# EAGLE design ITG-3200-v11 (EAGLE 6.4)
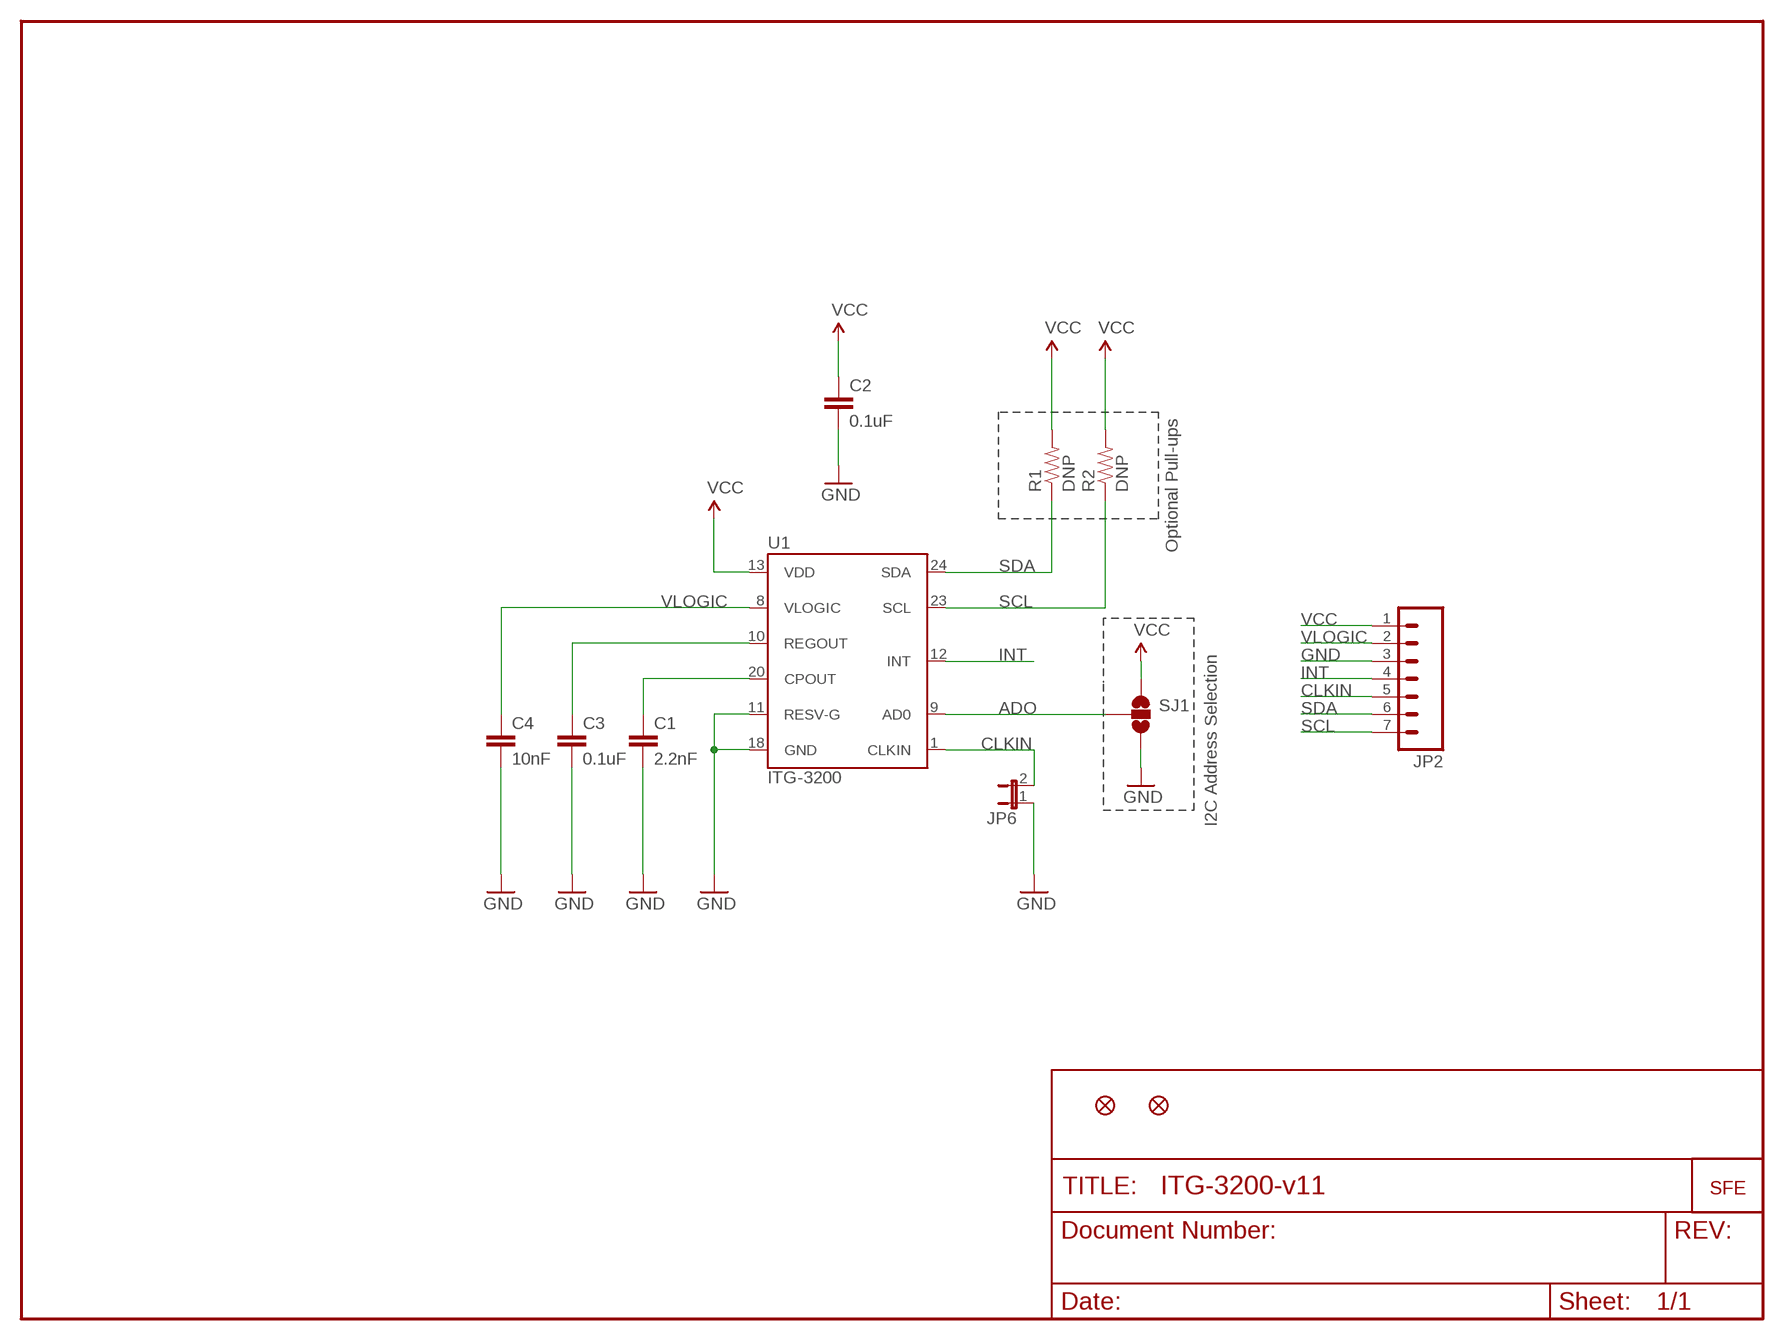
[diagram p0: schematic, sheet 1]

## Parts
C1  2.2nF  CAP0603-CAP  [0603-CAP]
C2  0.1uF  CAP0603-CAP  [0603-CAP]
C3  0.1uF  CAP0603-CAP  [0603-CAP]
C4  10nF  CAP0603-CAP  [0603-CAP]
JP1  LOGO-SFESK  [SFE-LOGO-FLAME]
JP2  M07  [1X07]
JP3  FIDUCIAL1X2  [FIDUCIAL-1X2]
JP4  FIDUCIAL1X2  [FIDUCIAL-1X2]
JP6  JUMPER-2SMD-NO  [SJ_2S-NO]
R1  DNP  RESISTOR0603-RES  [0603-RES]
R2  DNP  RESISTOR0603-RES  [0603-RES]
SJ1  SOLDERJUMPER_2WAYPASTE1&2  [SJ_3_PASTE1&2]
U1  ITG-3200  [QFN-24]

## Nets
ADO: SJ1.2 U1.9(AD0)
CLKIN: JP2.5 JP6.2 U1.1(CLKIN)
GND: C1.2 C2.2 C3.2 C4.2 JP2.3 JP6.1 SJ1.3 U1.11(RESV-G) U1.18(GND)
INT: JP2.4 U1.12(INT)
N$1: C1.1 U1.20(CPOUT)
N$2: C3.1 U1.10(REGOUT)
SCL: JP2.7 R2.1 U1.23(SCL)
SDA: JP2.6 R1.1 U1.24(SDA)
VCC: C2.1 JP2.1 R1.2 R2.2 SJ1.1 U1.13(VDD)
VLOGIC: C4.1 JP2.2 U1.8(VLOGIC)

## Notes on the sheet
- Optional Pull-ups
- I2C Address Selection

## Library data of the parts
C1-C4 = SparkFun:CAP: Capacitor Standard 0603 ceramic capacitor, and 0.1" leaded capacitor.
JP1 = SparkFun:LOGO-SFE: Spark Fun Electronics PCB Logo This is the standard Spark Fun Electronics PCB logo.
JP2 = SparkFun:M07: Header 7 Standard 7-pin 0.1" header. Use with straight break away headers (SKU : PRT-00116), right angle break away headers (PRT-00553), swiss pins (PRT-00743), machine pins (PRT-00117), and female headers (PRT-00115). NOTES ON THE VARIANTS LOCK and LOCK_LONGPADS... This footprint was designed to help hold the alignment of a through-hole component (i.e. 7-pin header) while soldering it into place. You may notice that each hole has been shifted either up or down by 0.005 of an inch from it's more standard position (which is usually a perfectly straight line). This slight alteration caused the pins (the squares in the middle) to touch the edges of the holes. Because they are alternating, it causes a "brace" to hold the header in place. 0.005 has proven to be the perfect amount of "off-center" position when using our standard breakaway headers. Although looks a little odd when you look at the bare footprint, once you have a header in there, the alteration is very hard to notice. Also, if you push a header all the way into place, it is covered up entirely on the bottom side. This idea of altering the position of holes to aid alignment will be further integrated into the Sparkfun Library for other footprints. It can help hold any component with 3 or more connection pins.
JP3 JP4 = SparkFun:FIDUCIAL: Fiducial Alignment Points Various fiducial points for machine vision alignment.
JP6 = SparkFun:JUMPER-2: Jumper Basic 0.1" spaced jumper. Use with breakaway headers.
R1 R2 = SparkFun:RESISTOR: Resistor Basic schematic elements and footprints for 0603, 1206, and PTH resistors.
SJ1 = SparkFun:SOLDERJUMPER_2WAY: Solder Jumper 2 way solder jumper
U1 = SparkFun:ITG-3200: ITG-3200 3-axis gyro, digital output, qfn24 package

## Board
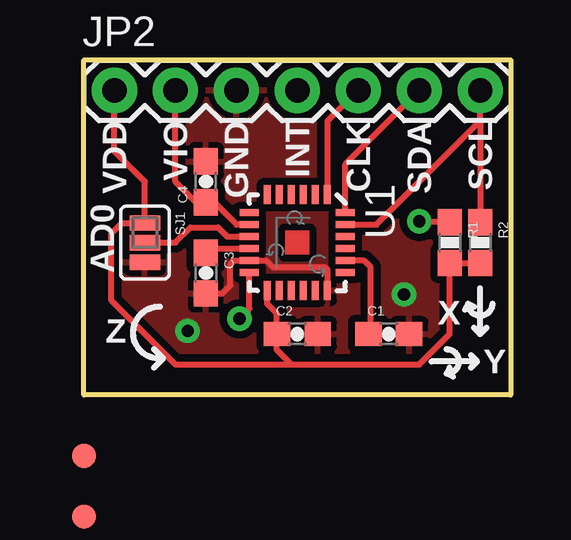
[diagram p1: board, top side]
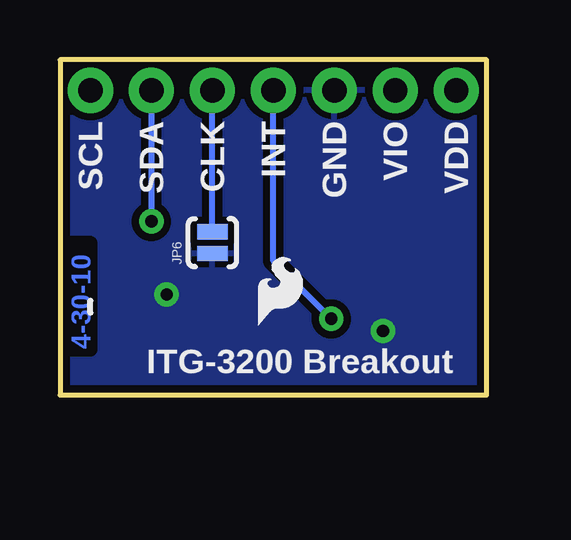
[diagram p2: board, bottom side, seen from below]

Size 17.78 x 13.97 mm. Coordinates in mm from the lower left corner, seen from the top.
Outline: 0,0 0,13.97 17.78,13.97 17.78,0 0,0
Copper layers (1*16): Top 0.035mm / dielectric 1.5mm / Bottom 0.035mm
Design rules "SparkFun": minimum track width 8mil, minimum drill 20mil, track to track 8mil, track to pad 8mil, pad to pad 8mil, via to via 8mil, smd to smd 8mil, copper to edge 8mil, drill to drill 8mil, minimum pad ring 12mil, minimum via ring 10mil, stop-mask expansion 4mil, vias tented up to drill 20mil, thermal gap 10mil

### Footprints (pad centres in the part's own frame; a part is rotated, then mirrored left to right if it is on the bottom)
0603-CAP = smd 1.1 x 1: 1 -0.85,0; 2 0.85,0
1X07 = drill 1.016 pad 1.88: 1 0,0; 2 2.54,0; 3 5.08,0; 4 7.62,0; 5 10.16,0; 6 12.7,0; 7 15.24,0
FIDUCIAL-1X2 = smd 1 x 1: 1 0,0
SJ_2S-NO = smd 0.635 x 1.27: 1 -0.45,0; 2 0.45,0
0603-RES = smd 1.1 x 1: 1 -0.85,0; 2 0.85,0
SJ_3_PASTE1&2 = smd 0.635 x 1.27: 1 -0.813,0; 2 0,0; 3 0.813,0
QFN-24 = smd 0.8 x 0.3: 1 -2,1.25; 2 -2,0.75; 3 -2,0.25; 4 -2,-0.25; 5 -2,-0.75; 6 -2,-1.25; 13 2,-1.25; 14 2,-0.75; 15 2,-0.25; 16 2,0.25; 17 2,0.75; 18 2,1.25 | smd 0.3 x 0.8: 7 -1.25,-2; 8 -0.75,-2; 9 -0.25,-2; 10 0.25,-2; 11 0.75,-2; 12 1.25,-2; 19 1.25,2; 20 0.75,2; 21 0.25,2; 22 -0.25,2; 23 -0.75,2; 24 -1.25,2

### Placement (x,y rotation side)
C1  12.7,2.54 0 top
C2  8.89,2.54 0 top
C3  5.08,5.08 270 top
C4  5.08,8.89 90 top
JP1  9.53,2.92 0 bottom
JP2  1.27,12.7 0 top
JP3  0,-2.54 0 top
JP4  0,-5.08 0 top  (outside the outline)
JP6  11.43,6.35 90 bottom
R1  15.24,6.35 270 top
R2  16.51,6.35 270 top
SJ1  2.54,6.35 270 top
U1  8.89,6.35 270 top

### Tracks (layer width: path | path; a pad name or v marks a point on that pad's centre or on a via)
ADO
  Top 0.254: U1.9 5.97,6.6 5.59,6.99 4.45,6.99 3.81,6.35 SJ1.2
CLKIN
  Top 0.254: 11.41,12.68 JP2.5 10.14,11.41 U1.1
  Bottom 0.254: JP6.2 JP2.5
GND  (via drill 0.51)
  Top 0.254: U1.11 6.24,5.6 6.1,5.46 6.1,4.57 5.75,4.23 C3.2 | U1.11 6.9,5.59 | U1.18 10.14,5.23 10.03,5.33 7.87,5.33 7.61,5.6 U1.11
  other vias: 13.34,4.19 4.32,2.67
  pour Top (isolate 0.305): 0,0 0,13.97 17.78,13.97 17.78,0
  pour Bottom (isolate 0.305): 0,0 0,13.97 17.78,13.97 17.78,0
INT  (via drill 0.51)
  Top 0.254: U1.12 6.89,3.59 v6.48,3.17
  Bottom 0.254: JP2.4 8.89,5.59 v6.48,3.17
N$1
  Top 0.254: U1.20 11.67,5.6 11.94,5.33 11.94,2.63 C1.1
N$2
  Top 0.254: U1.10 5.25,6.1 C3.1
SCL
  Top 0.254: U1.23 12.18,7.1 16.51,11.43 | 16.51,11.43 JP2.7 | 16.51,11.43 R2.1
SDA  (via drill 0.51)
  Top 0.254: U1.24 10.89,9.62 JP2.6 | v13.97,7.24 15.2,7.24 R1.1
  Bottom 0.254: JP2.6 v13.97,7.24
VCC
  Top 0.254: U1.13 7.64,3.83 7.62,3.81 8.04,3.39 C2.1 8.04,1.87 8.64,1.27 | JP2.1 1.27,10.16 2.54,8.89 SJ1.1 1.57,7.16 1.14,6.73 1.14,3.94 3.81,1.27 8.64,1.27 | R2.2 R1.2 15.24,2.54 13.97,1.27 8.64,1.27
VLOGIC
  Top 0.254: U1.8 6.36,7.1 5.42,8.04 C4.1 4.66,8.04 3.81,8.89 JP2.2

### Text on the board
Bottom: 4-30-10
tPlace: VDD | VIO | GND | INT | CLK | SDA | SCL | AD0 | X | Z | Y
bPlace: VDD | VIO | GND | INT | CLK | SDA | SCL | ITG-3200 Breakout